# EAGLE design v7.mainboard.rpizerow (EAGLE 9.5.1)
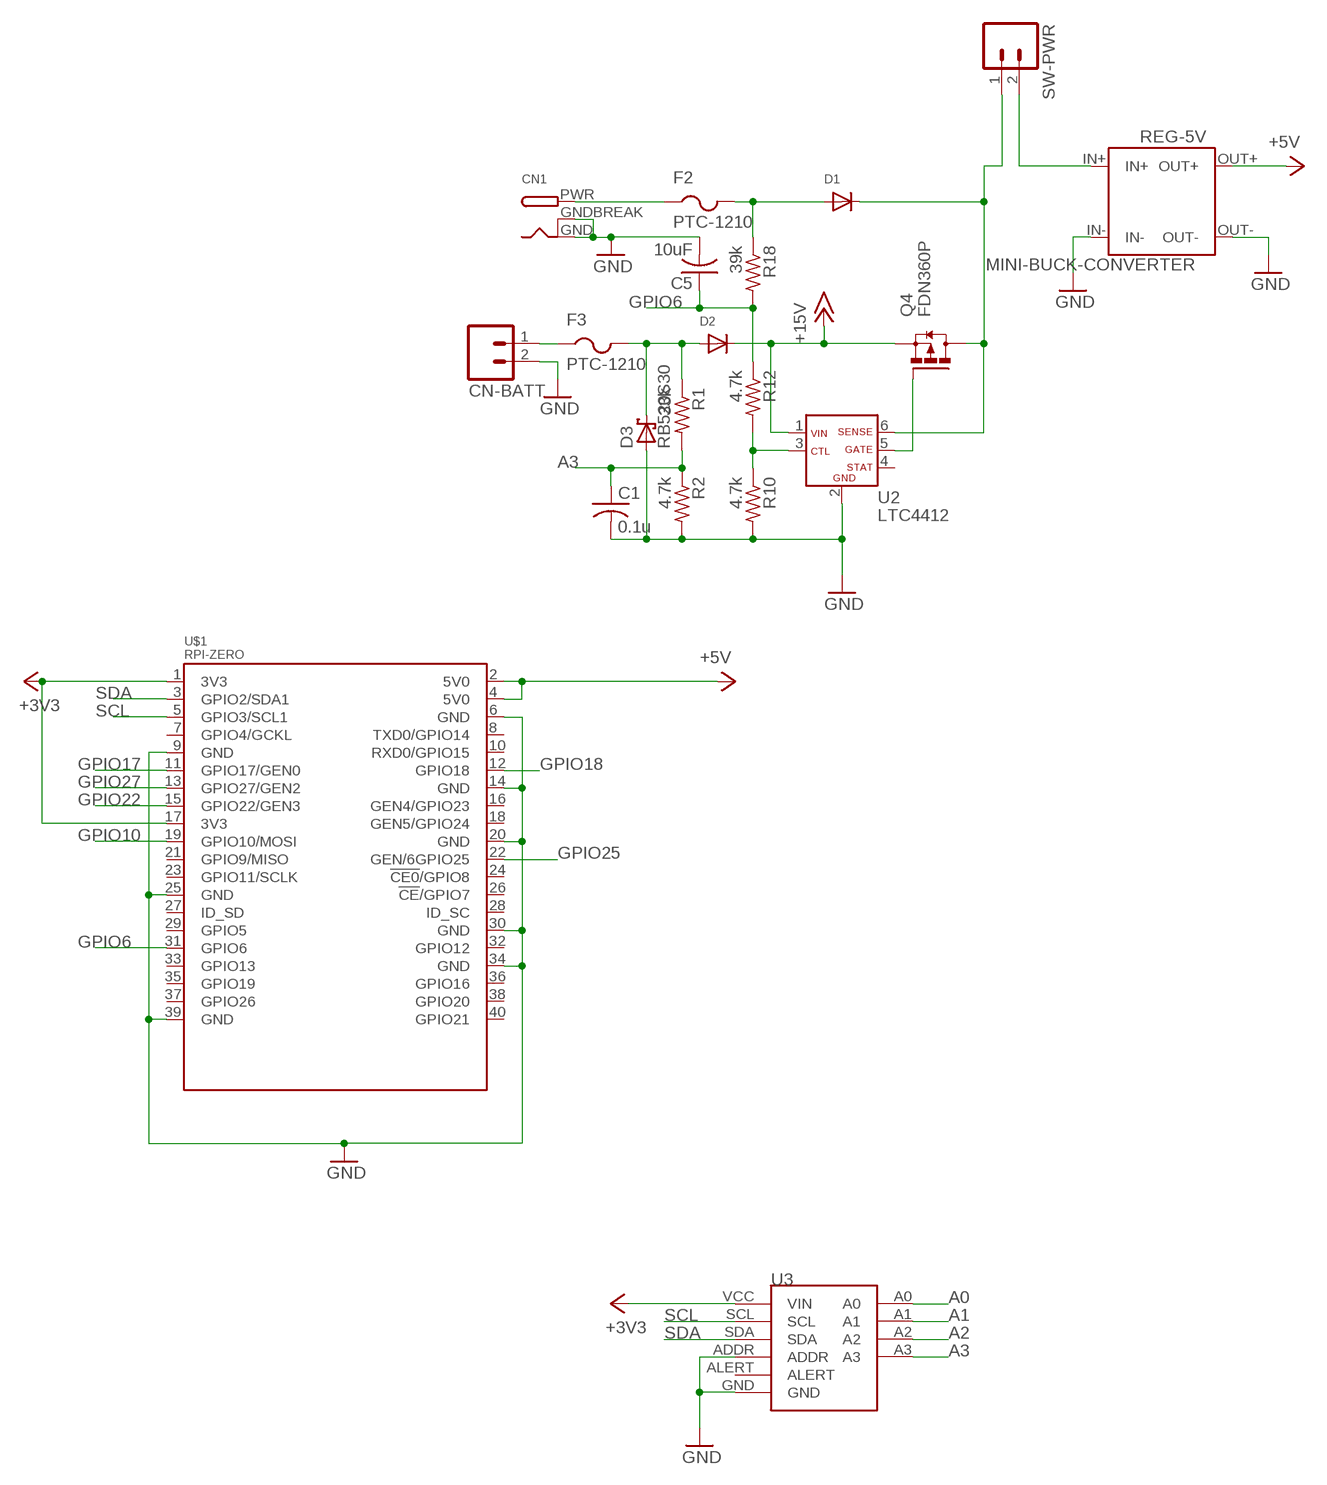
[diagram p0: schematic, sheet 1, part 1 of 2]
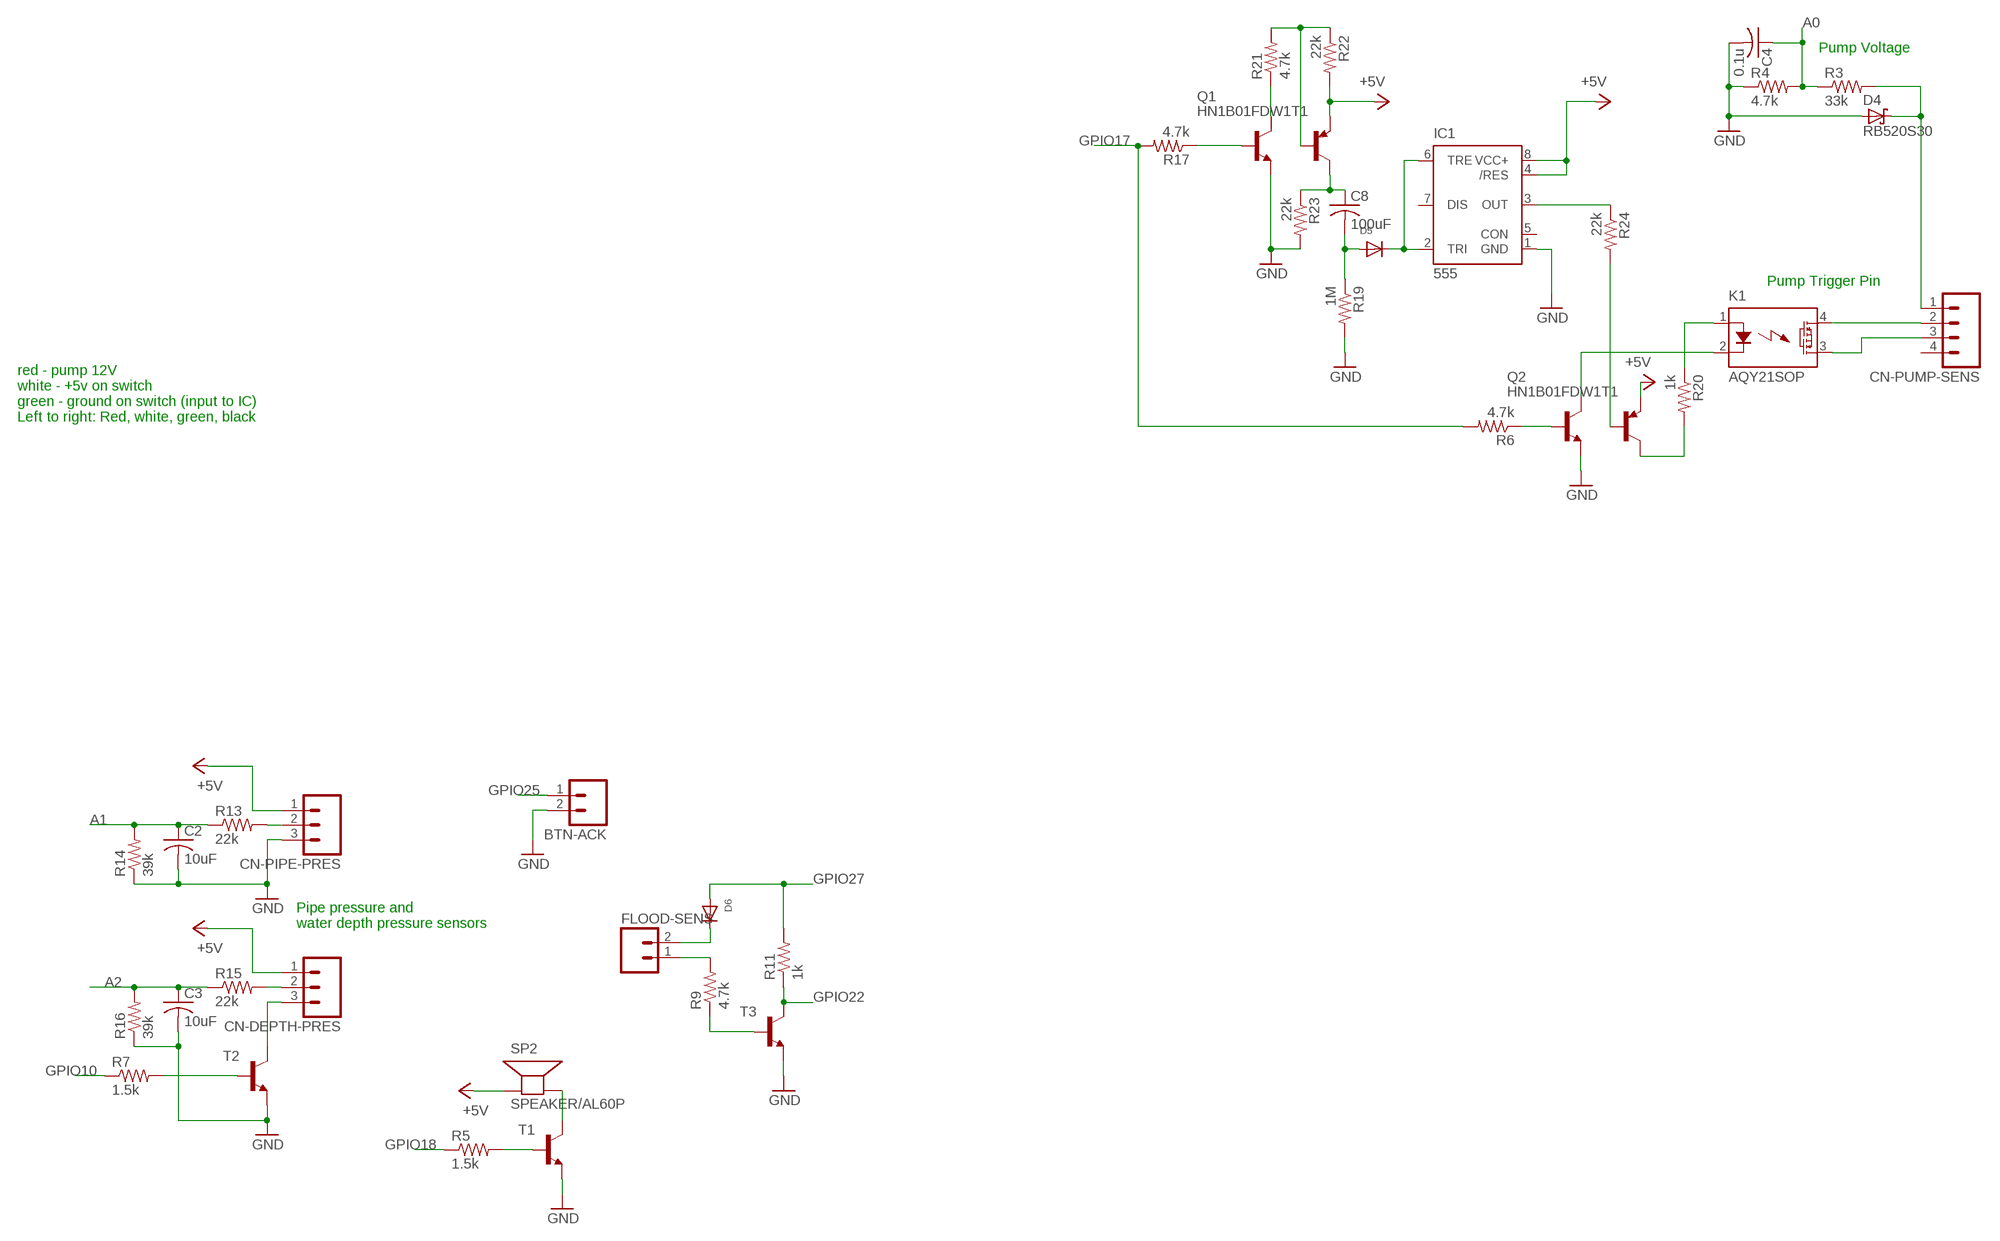
[diagram p1: schematic, sheet 1, part 2 of 2]

## Parts
BTN-ACK  M02  [02P]
C1  0.1u  C-USC0603K  [C0603K]
C2  10uF  C-USC0805K  [C0805K]
C3  10uF  C-USC0805K  [C0805K]
C4  0.1u  C-USC0603K  [C0603K]
C5  10uF  C-USC0805K  [C0805K]
C8  100uF  C-USC1210  [C1210]
CN1  DCBARRELPTH  [DCJACK_2MM_PTH]
CN-BATT  M02  [02P]
CN-DEPTH-PRES  M03  [03P]
CN-PIPE-PRES  M03  [03P]
CN-PUMP-SENS  M04  [04P]
D1  DIODESOD-323F  [SOD-323F]
D2  DIODESOD-323F  [SOD-323F]
D3  RB520S30  [SOD523]
D4  RB520S30  [SOD523]
D5  DIODESOD-323F  [SOD-323F]
D6  DIODESOD-323F  [SOD-323F]
F2  PTC-1210  [1210]
F3  PTC-1210  [1210]
FLOOD-SENS  M02  [02P]
IC1  555  555D  [SO08]
K1  AQY21SOP  [SOP04]
Q1  HN1B01FDW1T1  [SOT23-6]
Q2  HN1B01FDW1T1  [SOT23-6]
Q4  FDN360P  [SUPER-SOT3]
R1  33k  R-US_R0603  [R0603]
R2  4.7k  R-US_R0603  [R0603]
R3  33k  R-US_R0603  [R0603]
R4  4.7k  R-US_R0603  [R0603]
R5  1.5k  R-US_R0603  [R0603]
R6  4.7k  R-US_R0603  [R0603]
R7  1.5k  R-US_R0603  [R0603]
R9  4.7k  R-US_R0603  [R0603]
R10  4.7k  R-US_R0603  [R0603]
R11  1k  R-US_R0603  [R0603]
R12  4.7k  R-US_R0603  [R0603]
R13  22k  R-US_R0603  [R0603]
R14  39k  R-US_R0603  [R0603]
R15  22k  R-US_R0603  [R0603]
R16  39k  R-US_R0603  [R0603]
R17  4.7k  R-US_R0603  [R0603]
R18  39k  R-US_R0603  [R0603]
R19  1M  R-US_R0603  [R0603]
R20  1k  R-US_R0603  [R0603]
R21  4.7k  R-US_R0603  [R0603]
R22  22k  R-US_R0603  [R0603]
R23  22k  R-US_R0603  [R0603]
R24  22k  R-US_R0603  [R0603]
REG-5V  MINI-BUCK-CONVERTER  [MINI-BUCK-CONVERTER]
SP2  SPEAKER/AL60P  [AL60P]
SW-PWR  M02  [02P]
T1  BC808-NPN-SOT23-BEC  [SOT23-BEC]
T2  BC808-NPN-SOT23-BEC  [SOT23-BEC]
T3  BC808-NPN-SOT23-BEC  [SOT23-BEC]
U2  LTC4412  [SOT23-6]
U3  GY-ADS1115THM  [GY-ADS1115-THM]
U$1  RPI-ZERO  [RASPBERRYPI_BASTELSTUBE_V13_RASPI_BOARD_B+_FULL]

## Nets
+3V3: U3.VCC(VIN) U$1.1(3V3) U$1.17(3V3)
+5V: CN-DEPTH-PRES.1 CN-PIPE-PRES.1 IC1.4(/RES) IC1.8(VCC+) Q1.1(PNP-E) Q2.1(PNP-E) R22.2 REG-5V.OUT+ SP2.1(+) U$1.2(5V0) U$1.4(5V0)
+15V: D2.C Q4.2(S) U2.1(VIN)
A0: C4.1 R3.1 R4.2 U3.A0
A1: C2.1 R13.1 R14.2 U3.A1
A2: C3.1 R15.1 R16.2 U3.A2
A3: C1.1 R1.2 R2.1 U3.A3
GND: BTN-ACK.2 C1.2 C2.2 C3.2 C4.2 C5.2 CN1.GND CN1.GNDBREAK CN-BATT.2 CN-PIPE-PRES.3 D3.2(A) D4.2(A) IC1.1(GND) Q1.4(NPN-E) Q2.4(NPN-E) R2.2 R4.1 R10.2 R14.1 R16.1 R19.2 R23.2 REG-5V.IN- REG-5V.OUT- T1.E T2.E T3.E U2.2(GND) U3.ADDR U3.GND U$1.6(GND) U$1.9(GND) U$1.14(GND) U$1.20(GND) U$1.25(GND) U$1.30(GND) U$1.34(GND) U$1.39(GND)
GPIO6: C5.1 R12.1 R18.2 U$1.31(GPIO6)
GPIO10: R7.1 U$1.19(GPIO10/MOSI)
GPIO17: R6.2 R17.2 U$1.11(GPIO17/GEN0)
GPIO18: R5.1 U$1.12(GPIO18)
GPIO22: R11.1 T3.C U$1.15(GPIO22/GEN3)
GPIO25: BTN-ACK.1 U$1.22(GEN/6GPIO25)
GPIO27: D6.A R11.2 U$1.13(GPIO27/GEN2)
N$1: Q4.1(G) U2.5(GATE)
N$2: R10.1 R12.2 U2.3(CTL)
N$3: SP2.2(-) T1.C
N$4: CN-PUMP-SENS.1 D4.1(K) R3.2
N$5: REG-5V.IN+ SW-PWR.2
N$6: Q2.5(NPN-B) R6.1
N$7: CN-DEPTH-PRES.2 R15.2
N$8: R5.2 T1.B
N$9: CN-DEPTH-PRES.3 T2.C
N$10: CN-PIPE-PRES.2 R13.2
N$11: R9.1 T3.B
N$12: Q1.5(NPN-B) R17.1
N$13: D2.A D3.1(K) F3.2 R1.1
N$14: R7.2 T2.B
N$15: CN-BATT.1 F3.1
N$16: D1.C Q4.3(D) SW-PWR.1 U2.6(SENSE)
N$17: CN1.PWR F2.1
N$18: D1.A F2.2 R18.1
N$19: Q1.3(NPN-C) R21.1
N$20: FLOOD-SENS.1 R9.2
N$21: D6.C FLOOD-SENS.2
N$22: K1.1(A) R20.1
N$23: Q1.2(PNP-B) R21.2 R22.1
N$24: C8.1 Q1.6(PNP-C) R23.1
N$25: C8.2 D5.A R19.1
N$26: D5.C IC1.2(TRI) IC1.6(TRE)
N$27: IC1.3(OUT) R24.1
N$28: K1.2(K) Q2.3(NPN-C)
N$29: Q2.6(PNP-C) R20.2
N$30: Q2.2(PNP-B) R24.2
N$31: CN-PUMP-SENS.2 K1.4(DS1)
N$32: CN-PUMP-SENS.3 K1.3(DS2)
SCL: U3.SCL U$1.5(GPIO3/SCL1)
SDA: U3.SDA U$1.3(GPIO2/SDA1)
Unconnected: CN-PUMP-SENS.4 IC1.5(CON) IC1.7(DIS) U2.4(STAT) U3.ALERT U$1.7(GPIO4/GCKL) U$1.8(TXD0/GPIO14) U$1.10(RXD0/GPIO15) U$1.16(GEN4/GPIO23) U$1.18(GEN5/GPIO24) U$1.21(GPIO9/MISO) U$1.23(GPIO11/SCLK) U$1.24(!CE0!/GPIO8) U$1.26(!CE!/GPIO7) U$1.27(ID_SD) U$1.28(ID_SC) U$1.29(GPIO5) U$1.32(GPIO12) U$1.33(GPIO13) U$1.35(GPIO19) U$1.36(GPIO16) U$1.37(GPIO26) U$1.38(GPIO20) U$1.40(GPIO21)

## Notes on the sheet
- Pump Voltage
- Pump Trigger Pin
- red - pump 12V
  white - +5v on switch
  green - ground on switch (input to IC)
  Left to right: Red, white, green, black
- Pipe pressure and 
  water depth pressure sensors

## Library data of the parts
BTN-ACK CN-BATT FLOOD-SENS SW-PWR = con-amp-quick:M02: AMP QUICK CONNECTOR; OC_FARNELL: unknown; OC_NEWARK: unknown
C1-C5 C8 = adafruit:C-US: CAPACITOR, American symbol
CN1 = adafruit:DCBARREL: 2.0mm DC Barrel Jack DCJACK_2MM_PTH - Through Hole Jack (4UConnector: 05537)
CN-DEPTH-PRES CN-PIPE-PRES = con-amp-quick:M03: AMP QUICK CONNECTOR; OC_FARNELL: unknown; OC_NEWARK: unknown
CN-PUMP-SENS = con-amp-quick:M04: AMP QUICK CONNECTOR; OC_FARNELL: unknown; OC_NEWARK: unknown
D1 D2 D5 D6 = adafruit:DIODE: Diode SMADIODE - SMA Surface Mount Package 20V 1A Schottky Diode Digikey: 641-1014-6-ND DO-1N4148 - Through Hole Small Current Diode SOD-123 20V 1 A (.5mV Vf) Schottky Diode - Digikey: MBRX120TPMSCT-ND SOD-323 10V 570mA (.38mV Vf, 3ns) Schottky Diode - Digikey: ZLLS410CT-ND SOD-523 30V 30mA Schottky Diode (RB751S-40TE61) - Digikey: RB751S-40TE61CT-ND SOT23-R/W - SOT23 Package (R = Solder Paste/Reflow Ovens, W = Hand-Soldering) BAT54Film 40V 300mA - Digikey: 497-7162-1-ND
D3 D4 = nxp_60_1_1:RB520S30: 200 mA low Vf MEGA Schottky barrier rectifier Planar Maximum Ef?ciency General Application (MEGA) Schottky barrier recti?er with an integrated guard ring for stress protection, encapsulated in a SOD523 (SC-79) ultra small and ?at lead Surface-Mounted Device (SMD) plastic package. AAL Eindhoven MK
F2 F3 = serge:PTC-1210
IC1 = SparkFun-IC-Special-Function:555: General purpose bipolar Timer Datasheet <http://www.sparkfun.com/datasheets/Components/General/ne555.pdf> SparkFun Products SparkFun SparkPunk Sequencer Kit <https://www.sparkfun.com/products/12707> (KIT-12707) Storefront Component: 555 Timer <https://www.sparkfun.com/products/9273> (COM-09273) Two parts valid for production: VFP: IC-11930 (M7555 PTH) VFP: IC-09173 (555 PTH) - Preferred; PROD_ID: NA-XXXXX
K1 = relay:AQY*: PhotoMOS Relay NAiS Source: http://www.panasonic-electric-works.com/catalogues/downloads/photomos/ds_x615_en_aqz10_20.pdf; OC_FARNELL: unknown; OC_NEWARK: unknown
Q1 Q2 = serge:HN1B01FDW1T1: NPN/PNP transistor array Complementary Dual General Purpose Amplifier Transistor
Q4 = transistor-power:FDN360P: Single P-Channel, PowerTrench (R) MOSFET Source: http://www.fairchildsemi.com/ds/FD/FDN360P.pdf
R1-R7 R9-R24 = adafruit:R-US_: RESISTOR, American symbol
REG-5V = serge:MINI-BUCK-CONVERTER
SP2 = adafruit:SPEAKER: SPEAKER Source: Buerklin Added PS12 (for part # PS1240 piezo) http://www.ladyada.net/library/pcb/eaglelibrary.html
T1-T3 = transistor:*-NPN-: NPN Transistror BF959 corrected 2008.03.06
U2 = U-LT-LTC4412-ideal-diode:LTC4412
U3 = serge:GY-ADS1115
U$1 = RPI-Zero-wh:RPI-ZERO

## Board
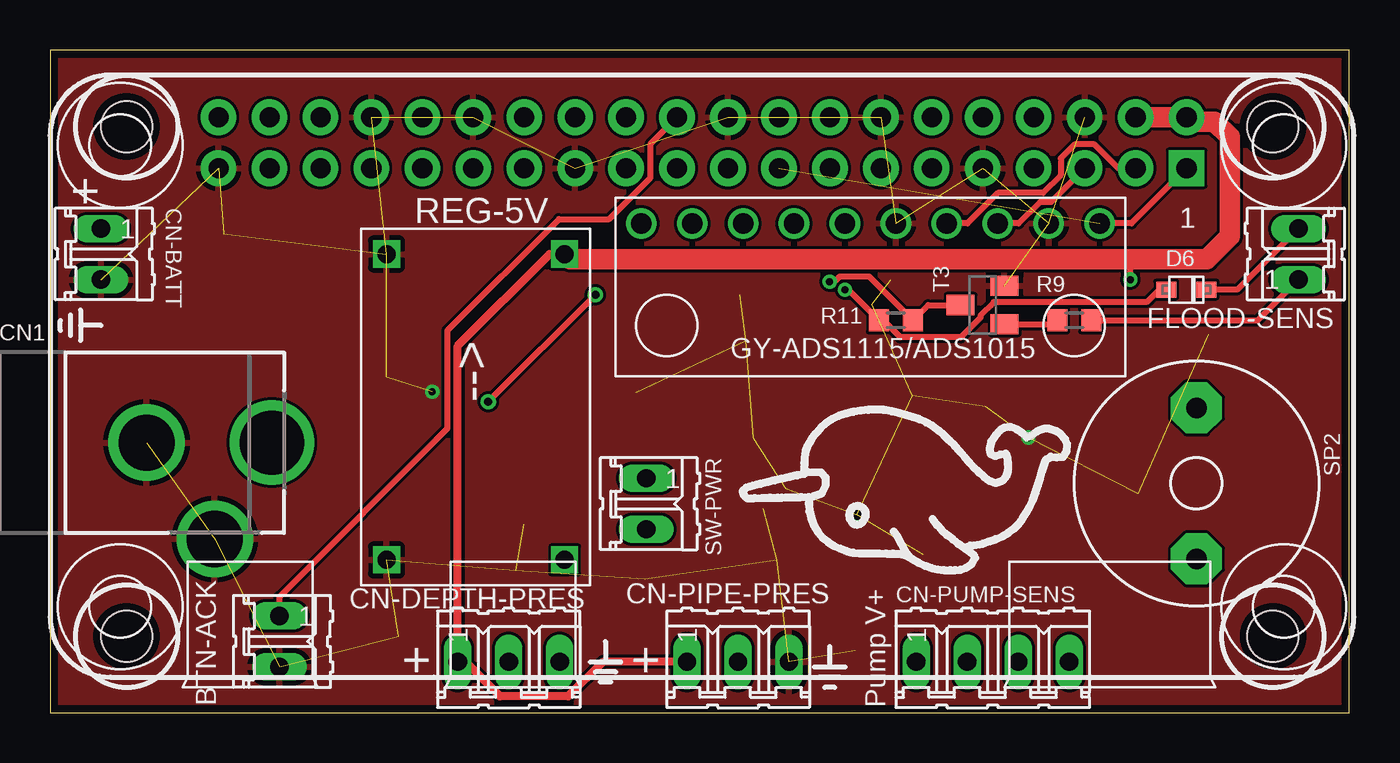
[diagram p2: board, top side]
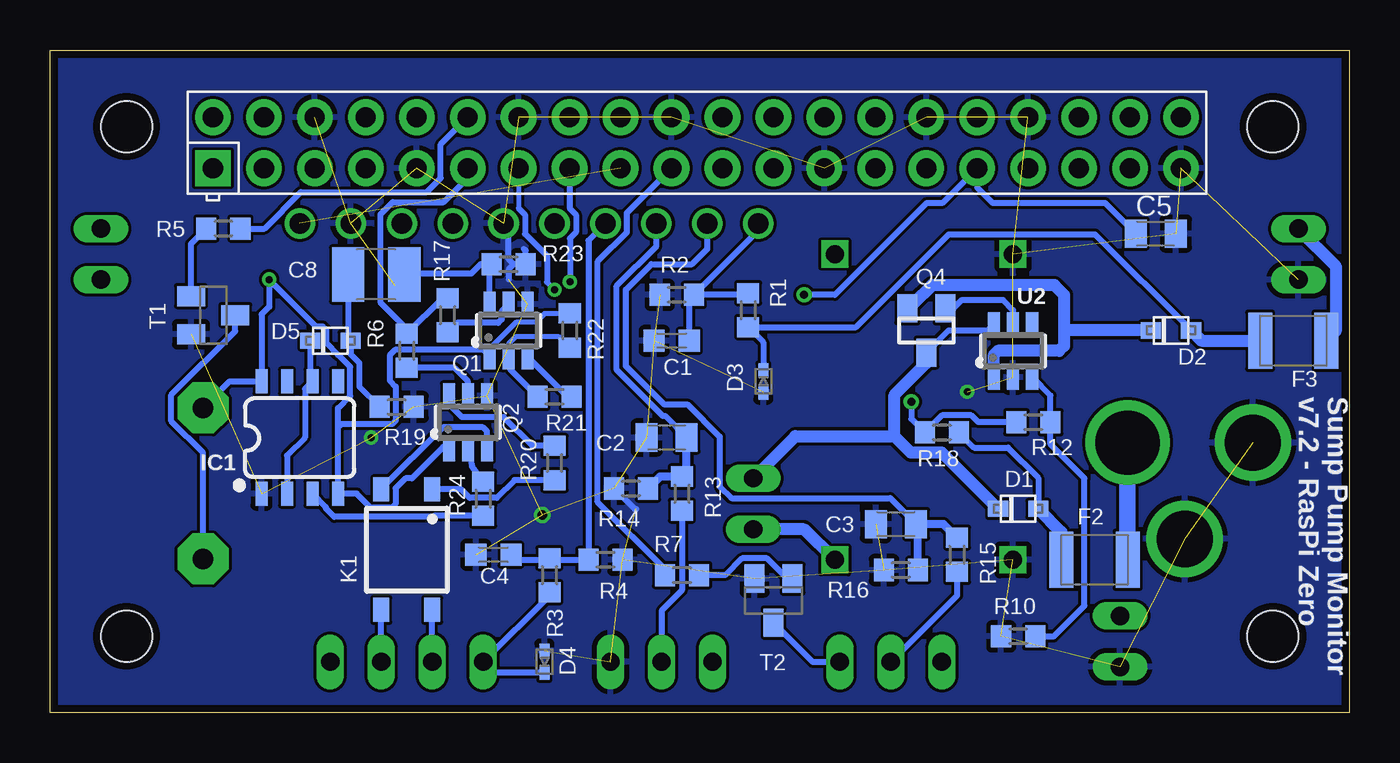
[diagram p3: board, bottom side, seen from below]

Size 64.77 x 33.02 mm. Coordinates in mm from the lower left corner, seen from the top.
Outline: 0,0 64.77,0 64.77,33.02 0,33.02 0,0
Copper layers (1*16): Top 0.0356mm / dielectric 1.5011mm / Bottom 0.0356mm
Design rules "LaenPCBOrder": minimum track width 6mil, minimum drill 13mil, track to track 6mil, track to pad 6mil, pad to pad 6mil, via to via 6mil, smd to smd 6mil, copper to edge 15mil, drill to drill 6mil, minimum pad ring 7mil, minimum via ring 7mil, stop-mask expansion 4mil, vias tented up to drill 0mil, thermal gap 10mil
Holes 2.54 mm at 3.81,3.81 60.96,3.81 60.96,29.21 3.81,29.21

### Footprints (pad centres in the part's own frame; a part is rotated, then mirrored left to right if it is on the bottom)
02P = drill 0.914 long: 1 -1.27,0; 2 1.27,0
C0603K = smd 1.05 x 1.08: 1 -0.875,0; 2 0.875,0
C0805K = smd 1.1 x 1.4: 1 -1,0; 2 1,0
C1210 = smd 1.6 x 2.7: 1 -1.4,0; 2 1.4,0
DCJACK_2MM_PTH = drill 2.8: GND 0,7.35; GNDBREAK 4.8,10.75 | drill 3.2: PWR 0,13.6
03P = drill 0.914 long: 1 -2.54,0; 2 0,0; 3 2.54,0
04P = drill 0.914 long: 1 -3.81,0; 2 -1.27,0; 3 1.27,0; 4 3.81,0
SOD-323F = smd 1 x 0.8: A -1,0; C 1,0
SOD523 = smd 0.7 x 0.5: 1 0.55,0; 2 -0.55,0
1210 = smd 1.2 x 2.8: 1 -1.65,0; 2 1.65,0
SO08 = smd 0.6 x 1.2: 1 -1.905,-2.8; 2 -0.635,-2.8; 3 0.635,-2.8; 4 1.905,-2.8; 5 1.905,2.8; 6 0.635,2.8; 7 -0.635,2.8; 8 -1.905,2.8
SOP04 = smd 0.8 x 1.2: 1 -1.27,-3; 2 1.27,-3; 3 1.27,3; 4 -1.27,3
SOT23-6 = smd 0.6 x 1.25: 1 0.95,1.31; 2 0,1.31; 3 -0.95,1.31; 4 -0.95,-1.31; 5 0,-1.31; 6 0.95,-1.31
SUPER-SOT3 = smd 1 x 1.4: 1 -0.95,-1.1; 2 0.95,-1.1; 3 0,1.1
R0603 = smd 1 x 1.1: 1 -0.85,0; 2 0.85,0
MINI-BUCK-CONVERTER = drill 0.9 square: IN+ 10.16,1.27; IN- 1.27,1.27; OUT+ 10.16,16.51; OUT- 1.27,16.51
AL60P = drill 1.016 pad 2.54 octagon: 1 -3.759,0; 2 3.759,0
SOT23-BEC = smd 1 x 1.4: B -0.95,-1.1; C 0,1.1; E 0.95,-1.1
GY-ADS1115-THM = drill 1.016: A0 -3.81,0; A1 -6.35,0; A2 -8.89,0; A3 -11.43,0; ADDR 1.27,0; ALERT -1.27,0; GND 8.89,0; SCL 6.35,0; SDA 3.81,0; VCC 11.43,0
RASPBERRYPI_BASTELSTUBE_V13_RASPI_BOARD_B+_FULL = drill 1 pad 1.778 square: 1 56.654,25.357 | drill 1 pad 1.778: 2 56.654,27.897; 3 54.114,25.357; 4 54.114,27.897; 5 51.574,25.357; 6 51.574,27.897; 7 49.034,25.357; 8 49.034,27.897; 9 46.494,25.357; 10 46.494,27.897; 11 43.954,25.357; 12 43.954,27.897; 13 41.414,25.357; 14 41.414,27.897; 15 38.874,25.357; 16 38.874,27.897; 17 36.334,25.357; 18 36.334,27.897; 19 33.794,25.357; 20 33.794,27.897; 21 31.254,25.357; 22 31.254,27.897; 23 28.714,25.357; 24 28.714,27.897; 25 26.174,25.357; 26 26.174,27.897; 27 23.634,25.357; 28 23.634,27.897; 29 21.094,25.357; 30 21.094,27.897; 31 18.554,25.357; 32 18.554,27.897; 33 16.014,25.357; 34 16.014,27.897; 35 13.474,25.357; 36 13.474,27.897; 37 10.934,25.357; 38 10.934,27.897; 39 8.394,25.357; 40 8.394,27.897

### Placement (x,y rotation side)
BTN-ACK  11.43,3.56 270 top
C1  33.78,18.54 180 bottom
C2  34.04,13.72 180 bottom
C3  22.61,9.4 180 bottom
C4  42.67,7.87 180 bottom
C5  9.65,23.88 0 bottom
C8  48.51,21.84 180 bottom
CN1  -2.54,13.46 270 top
CN-BATT  2.54,22.86 270 top
CN-DEPTH-PRES  22.86,2.54 0 top
CN-PIPE-PRES  34.29,2.54 0 top
CN-PUMP-SENS  46.99,2.54 0 top
D1  16.51,10.16 180 bottom
D2  8.89,19.05 180 bottom
D3  29.21,16.51 90 bottom
D4  40.13,2.54 270 bottom
D5  50.8,18.54 180 bottom
D6  56.64,21.08 0 top
F2  12.7,7.62 180 bottom
F3  2.79,18.54 180 bottom
FLOOD-SENS  62.23,22.86 90 top
IC1  52.32,13.72 0 bottom
K1  46.99,8.13 180 bottom
Q1  41.91,19.05 180 bottom
Q2  43.94,14.48 180 bottom
Q4  21.08,19.05 180 bottom
R1  29.97,20.07 90 bottom
R2  33.53,20.83 180 bottom
R3  39.88,6.86 270 bottom
R4  37.08,7.62 180 bottom
R5  56.13,24.13 180 bottom
R6  46.99,18.03 90 bottom
R7  33.27,6.86 0 bottom
R9  51.05,19.56 0 top
R10  16.51,3.81 180 bottom
R11  42.16,19.56 180 top
R12  15.75,14.48 0 bottom
R13  33.27,10.92 270 bottom
R14  35.81,11.18 0 bottom
R15  19.56,7.87 270 bottom
R16  22.35,7.11 0 bottom
R17  44.96,19.81 90 bottom
R18  20.32,13.97 180 bottom
R19  47.5,15.24 0 bottom
R20  39.62,12.45 90 bottom
R21  39.62,15.75 180 bottom
R22  38.86,19.05 90 bottom
R23  41.91,22.35 0 bottom
R24  43.18,10.67 90 bottom
REG-5V  15.49,6.35 0 top
SP2  57.15,11.43 270 top
SW-PWR  29.72,10.41 270 top
T1  56.64,19.81 270 bottom
T2  28.7,5.59 180 bottom
T3  46.48,20.32 90 top
U2  16.76,18.03 180 bottom
U3  40.89,24.38 0 top
U$1  0,1.78 0 top

### Tracks (layer width: path | path; a pad name or v marks a point on that pad's centre or on a via)
+3V3  (1 unrouted)
  Top 0.305: U$1.1 53.9,24.38 U3.VCC
+5V  (via drill 0.35)
  Top 0.305: v53.85,21.59 53.85,22.61
  Top 0.4: CN-PIPE-PRES.1 27.55,2.54 25.83,0.82 22.43,0.82 20.71,2.54 CN-DEPTH-PRES.1
  Top 0.406: CN-DEPTH-PRES.1 20.32,18.29 24.89,22.86 REG-5V.OUT+
  Top 1.016: U$1.4 U$1.2 56.87,29.46 58.04,29.46 58.8,28.7 58.8,23.75 57.66,22.61 53.85,22.61 25.91,22.61 REG-5V.OUT+
  Bottom 0.254: R22.2 40.1,19.9 40.54,19.46 41.55,19.46 42.86,18.15
  Bottom 0.305: SP2.1 55.82,16.52 IC1.8 54.23,19.85 53.85,20.23 v53.85,21.59 51.51,19.25 51.17,19.25 50.99,19.07 50.99,18.41 50.43,17.84 50.41,17.84 49.81,17.24 49.81,15.79 50.42,15.19 50.42,14.22 | 50.42,14.22 IC1.4 49.48,10.92 48.79,10.22 47.73,10.22 47.55,10.4 47.55,11.19 47.06,11.68 46.74,11.68 45.19,13.23 44.83,13.23 Q2.1 | 50.42,14.22 50.26,14.38 47.72,14.38 47.54,14.56 47.54,16.26 47.84,16.56 47.84,17.81 47.58,18.08 43.2,18.08 Q1.1 42.86,18.15
+15V
  Bottom 0.305: Q4.2 21.98,20.15 21.7,20.43
  Bottom 0.61: 21.7,20.43 20.82,21.31 14.7,21.31 14.22,20.83 14.22,19.05 | U2.1 17.71,17.85 17.53,18.03 14.48,18.03 14.22,18.29 14.22,19.05 | D2.C 14.22,19.05
A0
  Bottom 0.305: R3.1 39.79,7.62 | 39.79,7.62 R4.2 37.93,23.53 U3.A0 | C4.1 41.54,7.62 39.79,7.62
A1
  Bottom 0.305: U3.A1 34.54,23.25 36.52,21.27 36.52,17.08 34.23,14.78 34.1,14.78 C2.1
  Bottom 0.406: C2.1 33.04,12.01 R13.1 34.37,11.77 R14.2
A2
  Bottom 0.305: U3.A2 32,23.11 32.77,22.35 34.8,22.35 36.07,21.08 36.07,17.27 34.16,15.37 33.01,15.37 31.39,13.76 31.39,11.27 30.81,10.69 22.89,10.69 21.59,9.4
  Bottom 0.406: R15.1 20.23,9.4 21.59,9.4 C3.1 21.5,9.29 R16.2
A3
  Bottom 0.305: R2.1 30.06,20.83 R1.2 | R2.1 29.46,24.04 U3.A3 | C1.1 32.91,20.6 R2.1
GND  (via drill 0.35, 0.45)  (39 unrouted)
  Bottom 0.305: R14.1 35.65,10.16 35.56,10.16 | 41.15,23.11 41.06,23.03 R23.2 41.66,22.35 | 41.66,22.35 41.91,22.61 41.91,24.13 U3.ADDR | 41.66,22.35 41.91,22.1 41.91,21.59
  other vias: 48.77,13.72 40.23,9.86 19.05,16
  pour Top: -1.27,33.02 64.77,33.02 64.77,0 -1.27,0
  pour Bottom: -2.54,33.02 64.77,33.02 64.77,0 -2.54,0
GPIO6  (via drill 0.4)
  Top 0.305: v27.18,20.83 v21.84,15.49
  Bottom 0.305: R12.1 18.5,14.48 18.84,14.82 20.32,14.82 R18.2 21.84,14.64 v21.84,15.49 | v27.18,20.83 25.65,20.83 21.08,25.4 20.29,25.4 U$1.31 18.55,26.17 17.78,25.4 12.18,25.4 C5.1
GPIO10
  Bottom 0.305: R7.1 34.12,7.16 37.47,10.5 37.47,22.49 36.02,23.94 36.02,24.91 U$1.19
GPIO17
  Bottom 0.305: U$1.11 43.95,26.64 45.15,25.45 47.69,25.45 48.31,24.83 48.31,20.46 46.99,19.14 R6.2 45.21,20.66 R17.2
GPIO18
  Bottom 0.305: R5.1 54.09,24.13 52.27,25.94 46,25.94 45.3,26.64 45.3,28.33 U$1.12
GPIO22  (via drill 0.35)
  Top 0.305: T3.C 43.78,20.32 R11.1 40.83,21.74 39.35,21.74 39.1,21.49 v38.86,21.49
  Bottom 0.305: U$1.15 38.87,25.14 38.56,24.83 38.56,23.94 38.86,23.64 v38.86,21.49
GPIO25
  Top 0.305: BTN-ACK.1 11.43,5.79 19.81,14.17 19.81,19.05 25.36,24.6 27.87,24.6 29.91,26.64 29.91,28.33 U$1.22
GPIO27  (via drill 0.35)
  Top 0.305: v39.62,21.08 39.79,21.08 R11.2 41.53,19.56 42.39,18.7 45.4,18.7 46.39,19.69 46.39,19.81 47.05,20.46 54.67,20.46 55.29,21.08 D6.A
  Bottom 0.254: 40,21.46 v39.62,21.08 | U$1.13 41.41,25.14
  Bottom 0.305: 40,21.46 40,22.77 41.1,23.87 41.1,24.83 41.41,25.14
N$1
  Bottom 0.305: Q4.1 19.73,20.15 19.3,20.57 17.27,20.57 16.76,20.07 U2.5
N$2
  Bottom 0.305: R10.1 14.73,3.81 13.21,5.33 13.21,11.68 14.9,13.37 R12.2 14.9,15.81 U2.3
N$3
  Bottom 0.305: T1.C 55.54,19.02 58.73,15.84 58.73,14.54 57.15,12.96 SP2.2
N$4
  Bottom 0.305: D4.1 42.63,1.99 CN-PUMP-SENS.1 39.88,5.84 R3.2
N$5
  Bottom 0.61: REG-5V.IN+ 27.18,9.14 SW-PWR.2
N$6
  Bottom 0.305: Q2.5 43.94,16.51 44.62,17.18 R6.1
N$7
  Bottom 0.305: R15.2 19.56,5.84 CN-DEPTH-PRES.2
N$8
  Bottom 0.305: T1.B 57.74,23.37 R5.2
N$9
  Bottom 0.305: T2.C 26.75,2.54 CN-DEPTH-PRES.3
N$10
  Bottom 0.305: R13.2 33.27,6.1 34.29,5.08 CN-PIPE-PRES.2
N$11
  Top 0.305: T3.B 50.02,19.37 R9.1
N$12
  Bottom 0.305: Q1.5 42.26,20.02 42.26,19.61 42.43,19.43 44.49,19.43 R17.1
N$13
  Bottom 0.305: D2.A 12.68,23.84 19.97,23.84 24.6,19.22 R1.1 29.21,18.45 D3.1
  Bottom 0.61: D2.A 7.38,18.54 F3.2
N$14
  Bottom 0.305: T2.B 28.02,6.69 29.03,7.69 30.28,7.69 31.11,6.86 R7.2
N$15
  Bottom 0.61: CN-BATT.1 0.69,22.28 0.69,19 F3.1
N$16
  Bottom 0.305: Q4.3 19.98,19.05 18.01,19.05 U2.6
  Bottom 0.61: D1.C 20.31,12.96 21.86,12.96 22.68,13.78 | Q4.3 21.08,17.44 22.68,15.84 22.68,13.78 | SW-PWR.1 27.62,13.78 22.68,13.78
N$17
  Bottom 0.813: CN1.PWR F2.1
N$18
  Bottom 0.305: R18.1 18.71,13.21 17.02,13.21 15.51,11.7 D1.A
  Bottom 0.61: F2.2 14.35,9 D1.A
N$19
  Bottom 0.305: R21.1 38.97,15.75 Q1.3
N$20
  Top 0.305: R9.2 60.2,19.56 FLOOD-SENS.1
N$21
  Top 0.305: FLOOD-SENS.2 59.18,21.08 D6.C
N$22
  Bottom 0.305: R20.1 41.62,11.6 42.5,10.71 43.86,10.71 44.27,11.13 K1.1
N$23
  Bottom 0.254: R22.1 39.39,18.73 41.58,18.73 41.91,18.39 Q1.2 41.83,17.66 41.83,17.1
  Bottom 0.305: R21.2 41.83,17.1
N$24
  Bottom 0.305: C8.1 47.07,21.89 43.77,21.89 43.31,22.35 R23.1 42.86,22.25 Q1.6
N$25
  Bottom 0.305: C8.2 49.91,18.66 D5.A 49.8,17.88 49.36,17.43 49.36,16.25 R19.1
N$26
  Bottom 0.305: D5.C 51.8,16.63 IC1.6 52.07,16.14 52.07,13.72 52.96,12.83 IC1.2
N$27
  Bottom 0.305: R24.1 45.6,9.82 45.65,9.77 50.6,9.77 51.02,10.19 51.02,10.25 IC1.3
N$28
  Bottom 0.305: Q2.3 42.99,14.04 43.18,14.22 45.19,14.22 48.26,11.16 K1.2
N$29
  Bottom 0.305: R20.2 40.73,13.3 42.16,14.73 44.24,14.73 44.89,15.38 Q2.6
N$30
  Bottom 0.305: Q2.2 43.74,12.27 R24.2
N$31
  Bottom 0.305: CN-PUMP-SENS.2 K1.4
N$32
  Bottom 0.305: CN-PUMP-SENS.3 K1.3
SCL
  Top 0.305: U$1.5 49.89,25.45 49.34,25.45 48.27,24.38 U3.SCL
SDA
  Top 0.305: U3.SDA 45.73,24.38 47.26,25.91 49.49,25.91 50.38,26.79 50.38,27.63 51.08,28.33 52.07,28.33 53.26,27.14 U$1.3

### Text on the board
tPlace: + | + | + | Pump V+
bPlace: Sump Pump Monitor / v7.2 - RasPi Zero
tNames: -->